# EAGLE design BUZZI-22 (EAGLE 4.15)
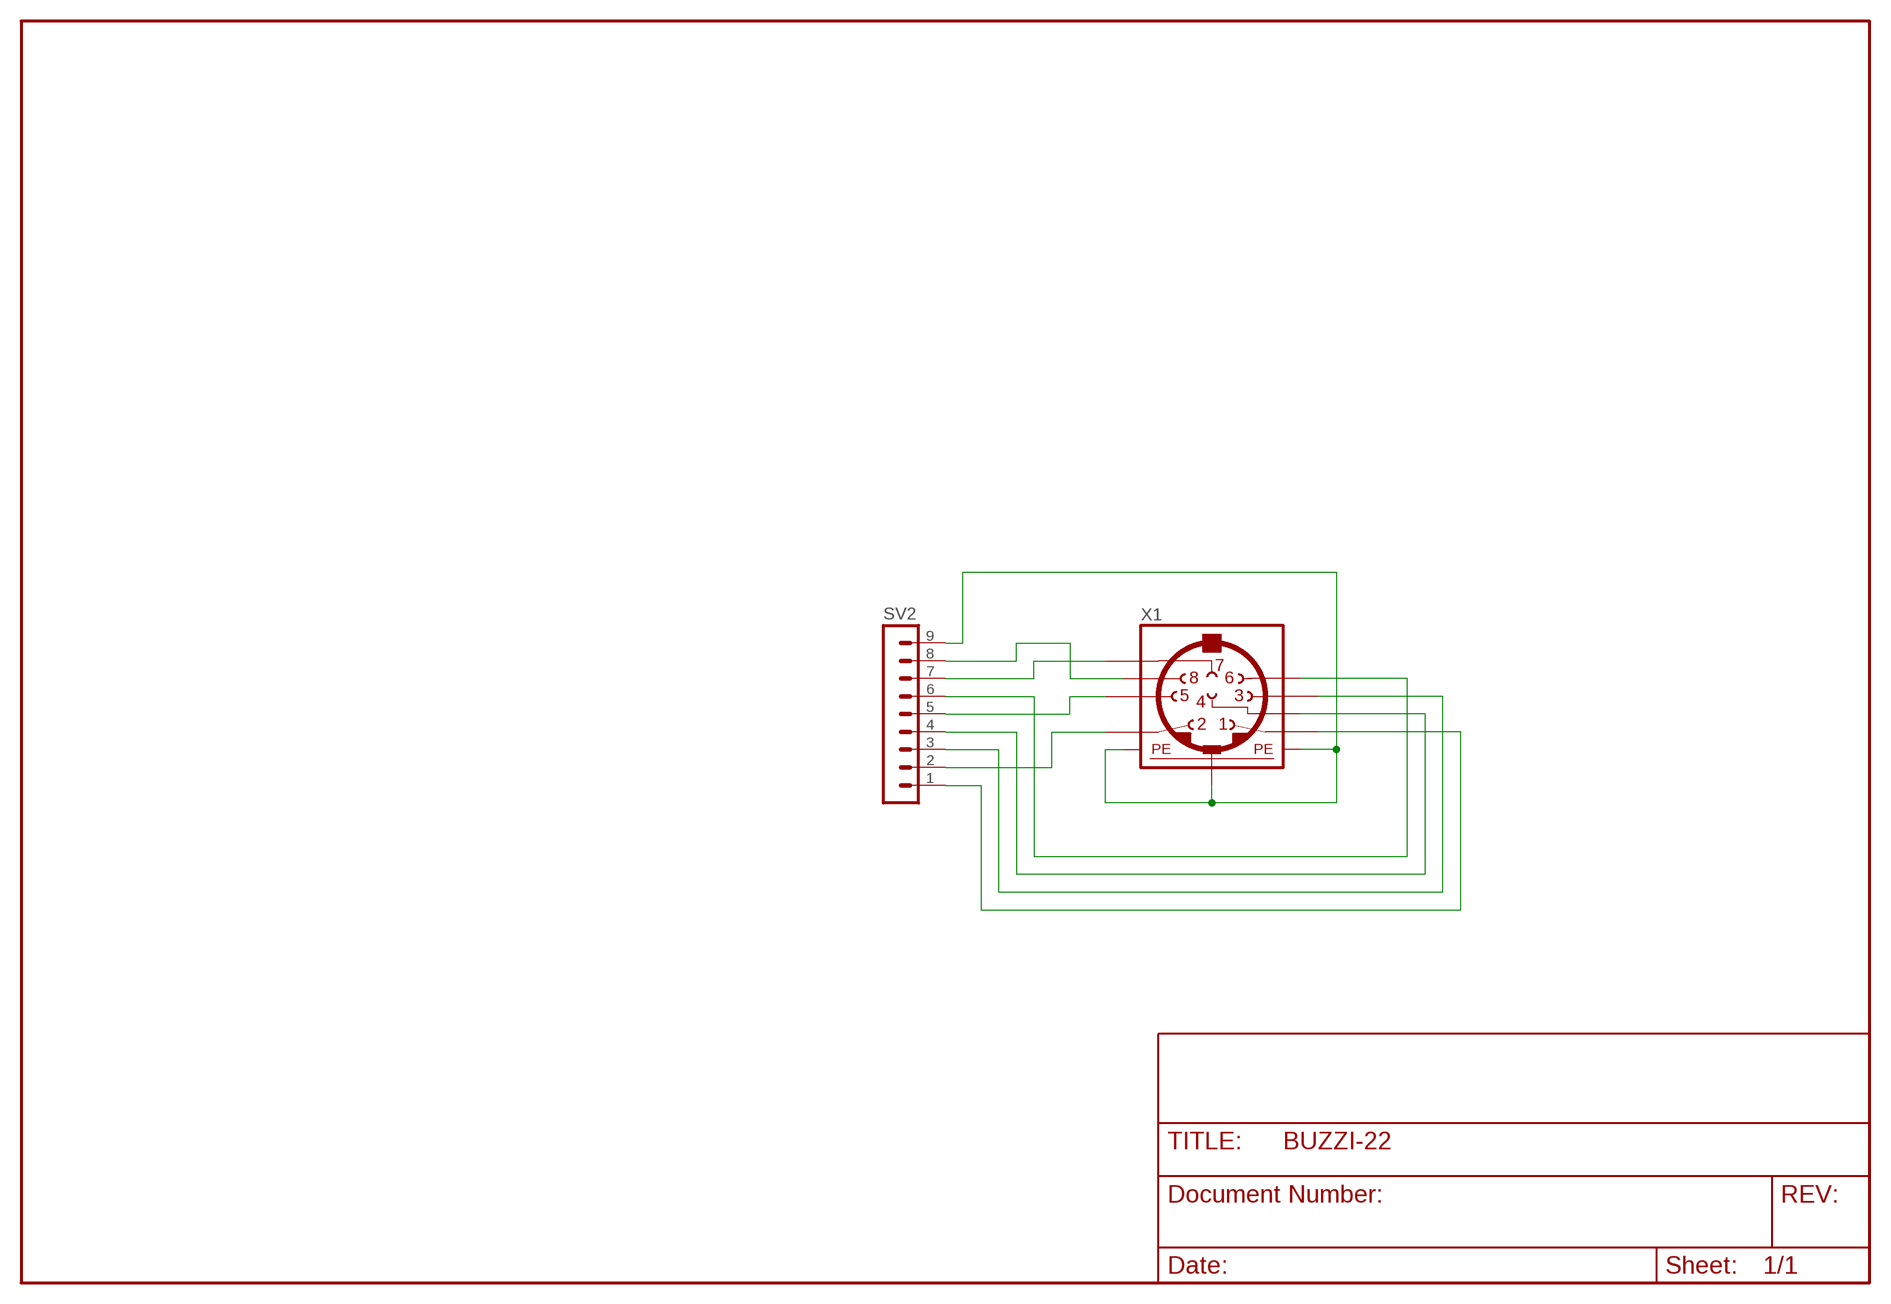
[diagram p0: schematic, sheet 1]

## Parts
SV2  MA09-1  [MA09-1]
X1  MINI_DIN_8  [M_DIN8]

## Nets
N$1: SV2.1 X1.1
N$2: SV2.2 X1.2
N$3: SV2.3 X1.3
N$4: SV2.4 X1.4
N$5: SV2.5 X1.5
N$6: SV2.6 X1.6
N$7: SV2.7 X1.7
N$8: SV2.8 X1.8
N$9: SV2.9 X1.SH1(PE1) X1.SH2(PE2) X1.SH3(PE3)

## Library data of the parts
SV2 = con-lstb:MA09-1: PIN HEADER
X1 = mini_din:MINI_DIN_8

## Net classes
0 default: width 0.3 mm

## Board
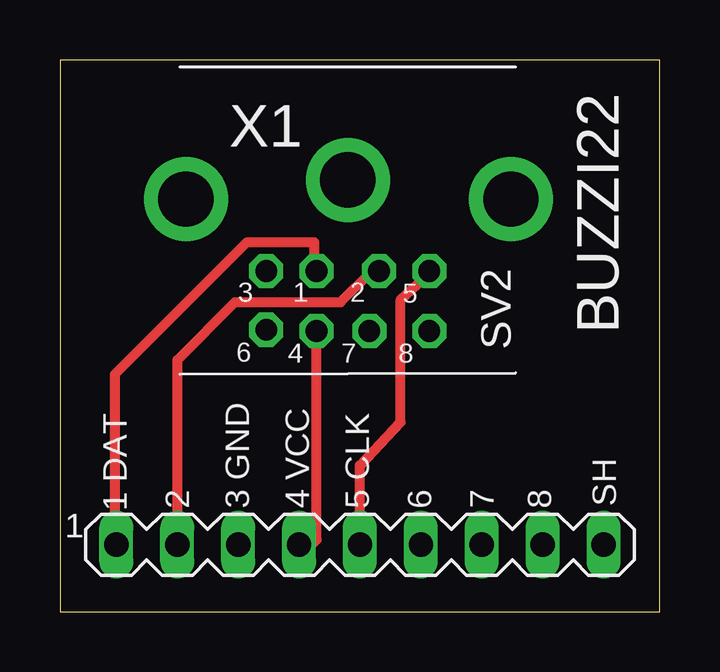
[diagram p1: board, top side]
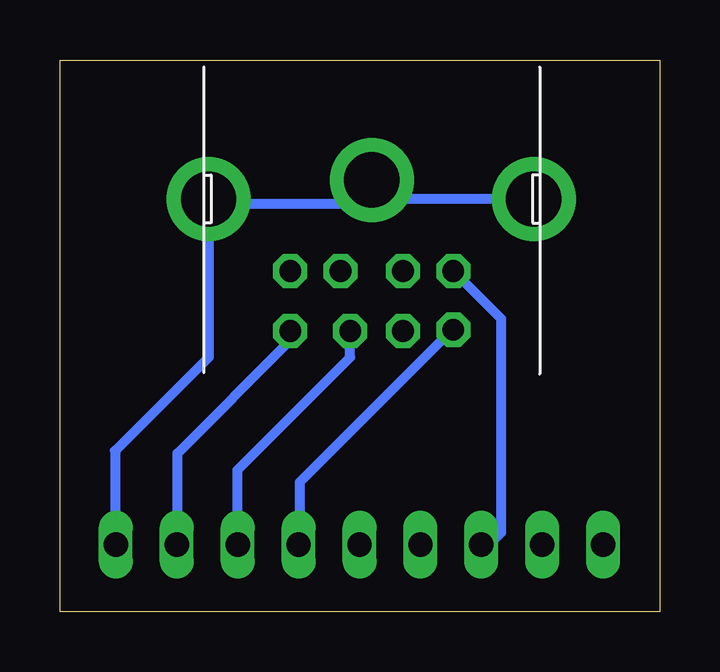
[diagram p2: board, bottom side, seen from below]

Size 25 x 23 mm. Coordinates in mm from the lower left corner, seen from the top.
Outline: 0,0 25,0 25,23 0,23 0,0
Copper layers (1*16): Top 0.035mm / dielectric 1.5mm / Bottom 0.035mm
Design rules "PCB-POOL": minimum track width 6mil, minimum drill 12mil, track to track 6mil, track to pad 6mil, pad to pad 6mil, via to via 6mil, smd to smd 6mil, copper to edge 20mil, drill to drill 8mil, minimum pad ring 8mil, minimum via ring 6mil, stop-mask expansion 3mil, vias tented up to drill 0mil, thermal gap 8mil

### Footprints (pad centres in the part's own frame; a part is rotated, then mirrored left to right if it is on the bottom)
MA09-1 = drill 1.016 long: 1 -10.16,0; 2 -7.62,0; 3 -5.08,0; 4 -2.54,0; 5 0,0; 6 2.54,0; 7 5.08,0; 8 7.62,0; 9 10.16,0
M_DIN8 = drill 0.9 pad 1.422 octagon: 1 -1.3,-3.8; 2 1.3,-3.8; 3 -3.4,-3.8; 4 -1.3,-6.3; 5 3.4,-3.8; 6 -3.4,-6.25; 7 0.9,-6.3; 8 3.4,-6.3 | drill 2.3 pad 3.5 round: SH1 6.8,-0.8; SH2 0,0; SH3 -6.75,-0.8

### Placement (x,y rotation side)
SV2  12.51,2.79 0 top
X1  12,18 0 top

### Tracks (layer width: path | path; a pad name or v marks a point on that pad's centre or on a via)
N$1
  Top 0.406: X1.1 10.6,14.2 10.6,15.4 7.8,15.4 2.3,9.9 2.3,2.2 2.35,2.25 SV2.1
N$2
  Top 0.406: X1.2 13,14.2 11.7,12.9 7.3,12.9 4.9,10.5 4.9,2.3 SV2.2
N$3
  Bottom 0.406: X1.3 6.6,12.2 6.6,3.3 7.5,2.4 7.43,2.33 SV2.3
N$4
  Top 0.406: SV2.4 9.99,2.29 10.7,3 X1.4
N$5
  Top 0.406: X1.5 15.4,14.1 14.2,13 14.2,7.9 12.5,6.1 12.5,2.2 12.51,2.19 | 12.51,2.19 12.6,2.1 | 12.51,2.19 SV2.5
N$6
  Bottom 0.406: X1.6 8.65,11.75 15,5.4 15,2.2 15.05,2.25 SV2.6
N$7
  Bottom 0.406: X1.7 12.9,10.6 17.6,5.9 17.6,2.2 17.59,2.21 SV2.7
N$8
  Bottom 0.406: X1.8 15.4,11.3 20.1,6.6 20.1,2.3 20.13,2.27 | 20.13,2.27 20.2,2.2 | 20.13,2.27 SV2.8
N$9
  Bottom 0.406: X1.SH3 11.2,17.2 X1.SH2 12.1,18 13.1,17 18.9,17 19.1,17.2 X1.SH1 18.8,10.6 22.7,6.7 22.7,2.3 22.71,2.29 | 22.71,2.29 22.8,2.2 | 22.71,2.29 SV2.9

### Text on the board
tNames: BUZZI22 | 1 DAT | 2 | 3 GND | 4 VCC | 5 CLK | 6 | 7 | 8 | SH